# EAGLE design sonar_hotfix_3 (EAGLE 9.0.0)
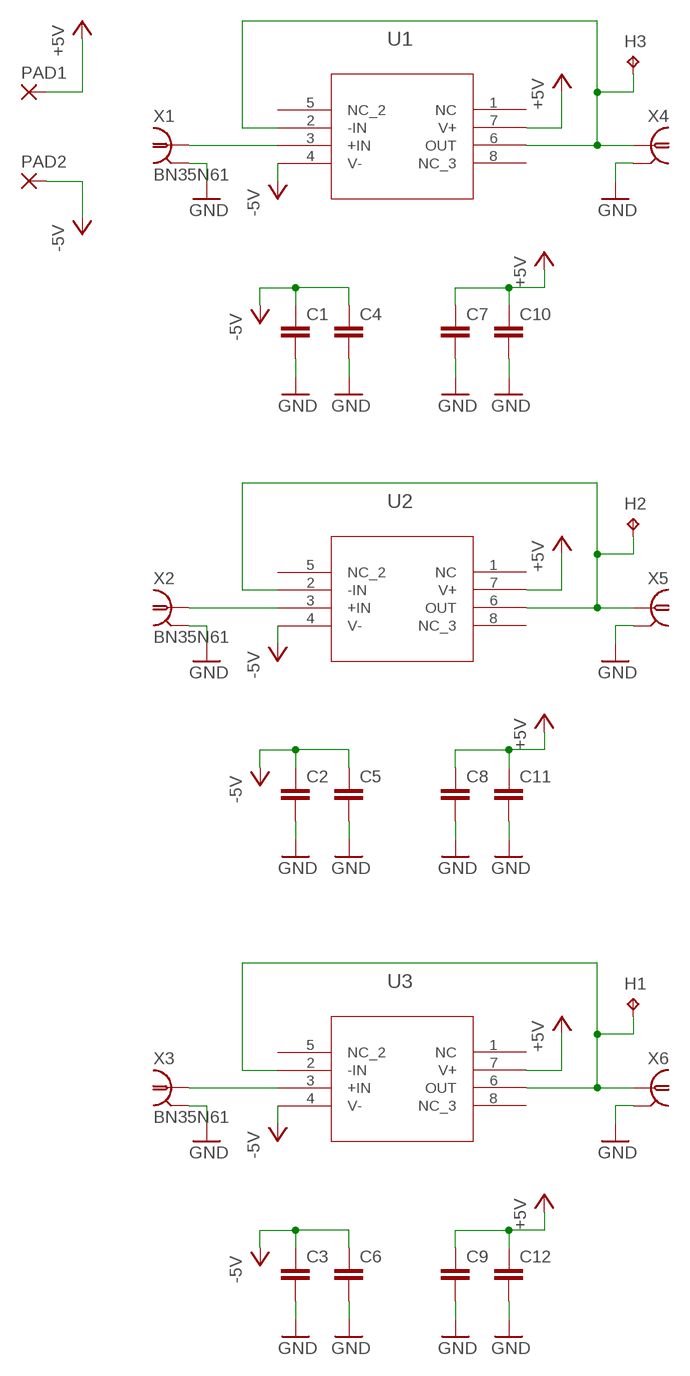
[diagram p0: schematic, sheet 1]

## Parts
C1  C-EUC0603  [C0603]
C2  C-EUC0603  [C0603]
C3  C-EUC0603  [C0603]
C4  C-EUC0603  [C0603]
C5  C-EUC0603  [C0603]
C6  C-EUC0603  [C0603]
C7  C-EUC0603  [C0603]
C8  C-EUC0603  [C0603]
C9  C-EUC0603  [C0603]
C10  C-EUC0603  [C0603]
C11  C-EUC0603  [C0603]
C12  C-EUC0603  [C0603]
H1  TPB2,54  [B2,54]
H2  TPB2,54  [B2,54]
H3  TPB2,54  [B2,54]
PAD1  WIREPADSMD5-2,5  [5-2,5]
PAD2  WIREPADSMD5-2,5  [5-2,5]
U1  LTC6240SO-8  [SO-8]
U2  LTC6240SO-8  [SO-8]
U3  LTC6240SO-8  [SO-8]
X1  BN35N61  [B35N61]
X2  BN35N61  [B35N61]
X3  BN35N61  [B35N61]
X4  BN35N61-HALF  [B35N61-HALF]
X5  BN35N61-HALF  [B35N61-HALF]
X6  BN35N61-HALF  [B35N61-HALF]

## Nets
+5V: C7.1 C8.1 C9.1 C10.1 C11.1 C12.1 PAD1.1(P) U1.7(V+) U2.7(V+) U3.7(V+)
-5V: C1.1 C2.1 C3.1 C4.1 C5.1 C6.1 PAD2.1(P) U1.4(V-) U2.4(V-) U3.4(V-)
GND: C1.2 C2.2 C3.2 C4.2 C5.2 C6.2 C7.2 C8.2 C9.2 C10.2 C11.2 C12.2 X1.2 X1.3 X1.4 X1.5 X2.2 X2.3 X2.4 X2.5 X3.2 X3.3 X3.4 X3.5 X4.2 X4.3 X5.2 X5.3 X6.2 X6.3
N$1: U1.3(+IN) X1.1
N$2: H3.TP U1.2(-IN) U1.6(OUT) X4.1
N$5: U2.3(+IN) X2.1
N$6: H2.TP U2.2(-IN) U2.6(OUT) X5.1
N$9: U3.3(+IN) X3.1
N$10: H1.TP U3.2(-IN) U3.6(OUT) X6.1
Unconnected: U1.1(NC) U1.5(NC_2) U1.8(NC_3) U2.1(NC) U2.5(NC_2) U2.8(NC_3) U3.1(NC) U3.5(NC_2) U3.8(NC_3)

## Library data of the parts
C1-C12 = rcl:C-EU: CAPACITOR, European symbol; SPICEPREFIX: C
H1-H3 = testpad:TP: Test pad
PAD1 PAD2 = wirepad:WIREPAD: Wire PAD connect wire on PCB
U1-U3 = hotfix:LTC6240
X1-X3 = ARVP:BN35N61: BNC CONNECTOR M/A COM www.macom.com distributor Farnell 149-452; OC_FARNELL: unknown; OC_NEWARK: unknown
X4-X6 = ARVP:BN35N61-HALF: BNC CONNECTOR M/A COM www.macom.com distributor Farnell 149-452

## Board
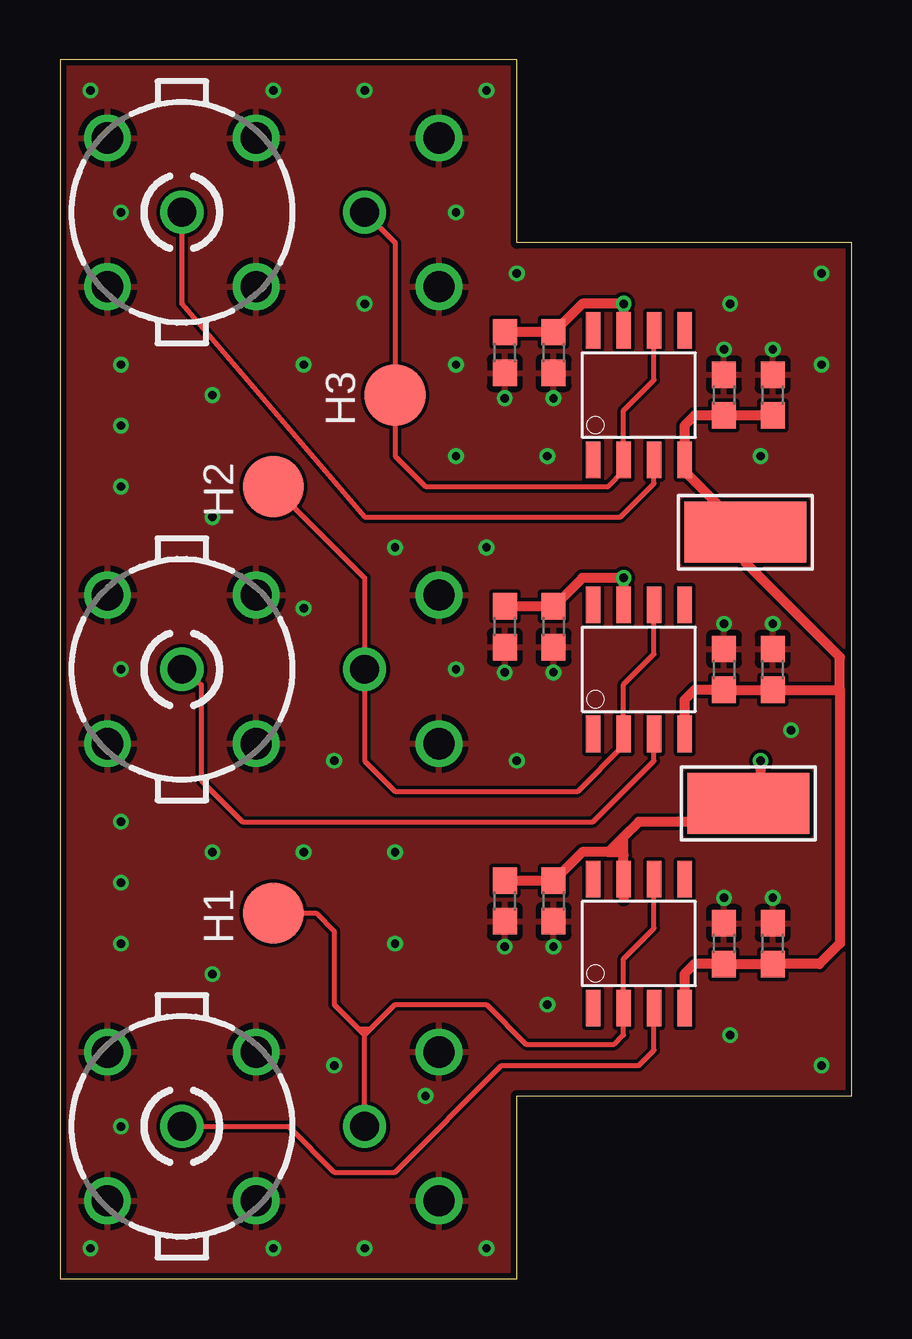
[diagram p1: board, top side]
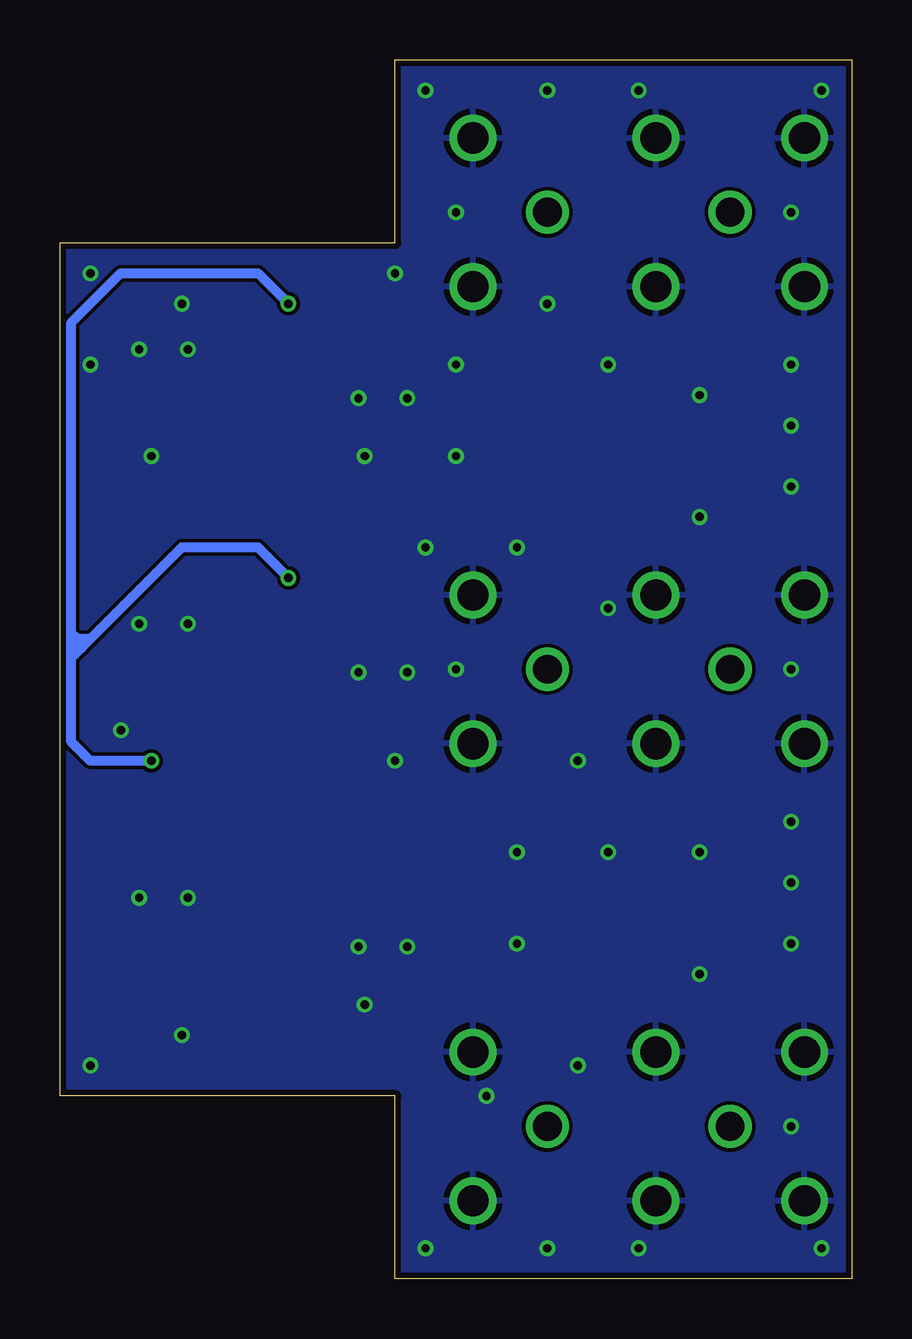
[diagram p2: board, bottom side, seen from below]

Size 33.02 x 50.8 mm. Coordinates in mm from the lower left corner, seen from the top.
Outline: 33,43.18 33.02,43.18
Outline: 33,43.18 19.05,43.18 19.05,50.8 0,50.8 0,0 19.05,0 19.05,7.62 33,7.62
Outline: 33,7.62 33,43.18
Outline: 33.02,7.62 33,7.62
Copper layers (1*16): Top 0.035mm / dielectric 1.5mm / Bottom 0.035mm
Design rules "JLCPCB2Layer": minimum track width 6mil, minimum drill 10mil, track to track 6mil, track to pad 6mil, pad to pad 6mil, via to via 6mil, smd to smd 0mil, copper to edge 10mil, drill to drill 10mil, minimum pad ring 6mil, minimum via ring 6mil, stop-mask expansion 2mil, vias tented up to drill 100mil, thermal gap 10mil

### Footprints (pad centres in the part's own frame; a part is rotated, then mirrored left to right if it is on the bottom)
C0603 = smd 1.1 x 1: 1 -0.85,0; 2 0.85,0
B2,54 = smd 2.54 x 2.54: TP 0,0
5-2,5 = smd 2.54 x 5.08: 1 0,0
SO-8 = smd 1.524 x 0.61: 1 -2.692,1.905; 2 -2.692,0.635; 3 -2.692,-0.635; 4 -2.692,-1.905; 5 2.692,-1.905; 6 2.692,-0.635; 7 2.692,0.635; 8 2.692,1.905
B35N61 = drill 1.2: 1 0,0 | drill 1.3: 2 3.099,3.099; 3 -3.099,3.099; 4 -3.099,-3.099; 5 3.099,-3.099
B35N61-HALF = drill 1.2: 1 0,0 | drill 1.3: 2 3.099,3.099; 3 -3.099,3.099

### Placement (x,y rotation side)
C1  27.69,36.83 90 top
C2  27.69,25.4 90 top
C3  27.69,13.97 90 top
C4  29.72,36.83 90 top
C5  29.72,25.4 90 top
C6  29.72,13.97 90 top
C7  18.54,38.61 270 top
C8  18.54,27.18 270 top
C9  18.54,15.75 270 top
C10  20.57,38.61 270 top
C11  20.57,27.18 270 top
C12  20.57,15.75 270 top
H1  8.89,15.24 90 top
H2  8.89,33.02 90 top
H3  13.97,36.83 90 top
PAD1  28.7,19.81 90 top
PAD2  28.58,31.11 270 top
U1  24.13,36.83 90 top
U2  24.13,25.4 90 top
U3  24.13,13.97 90 top
X1  5.08,44.45 270 top
X2  5.08,25.4 270 top
X3  5.08,6.35 270 top
X4  12.7,44.45 270 top
X5  12.7,25.4 270 top
X6  12.7,6.35 270 top

### Tracks (layer width: path | path; a pad name or v marks a point on that pad's centre or on a via)
+5V  (via drill 0.35)
  Top 0.406: 23.49,18.41 24.13,19.05 27.94,19.05 PAD1.1 29.21,20.32 v29.21,21.59 | 23.49,15.88 U3.7 23.49,17.65 | U2.7 v23.49,29.21 21.77,29.21 20.59,28.03 C11.1 C8.1 18.54,28.25 | U1.7 v23.49,40.64 21.77,40.64 20.59,39.46 C10.1 C7.1 | 23.49,17.65 23.49,18.41 | 23.49,18.41 23.11,18.03 | 23.11,18.03 22.86,17.78 | 18.54,16.82 C9.1 C12.1 20.59,16.6 21.77,17.78 22.86,17.78 | 23.37,17.78 23.11,18.03 | 22.86,17.78 23.37,17.78 | 23.37,17.78 23.49,17.65
  Bottom 0.406: v29.21,21.59 31.75,21.59 32.54,22.38 32.54,25.88 | 32.54,25.88 32.54,26.29 | 32.54,26.29 32.54,26.67 | 32.54,26.67 32.54,26.92 | 32.54,26.92 32.54,39.85 30.48,41.91 24.77,41.91 v23.49,40.64 | v23.49,29.21 24.77,30.48 27.94,30.48 31.75,26.67 | 32.13,26.29 32.54,25.88 | 32.29,26.67 32.54,26.67 | 31.75,26.67 32.13,26.29 | 32.13,26.29 32.54,26.29 | 31.75,26.67 32.29,26.67 | 32.29,26.67 32.54,26.92
-5V
  Top 0.406: C4.1 C1.1 26.45,35.98 26.03,35.56 U1.4 26.03,33.66 PAD2.1 28.58,29.84 32.51,25.91 32.51,24.55 | U3.4 26.03,12.7 26.45,13.12 C3.1 C6.1 31.66,13.12 32.51,13.97 32.51,24.55 | U2.4 26.03,24.13 26.45,24.55 C2.1 C5.1 32.51,24.55
GND  (via drill 0.35)
  other vias: 2.54,38.1 2.54,35.56 2.54,33.02 2.54,19.05 2.54,16.51 2.54,13.97 6.35,17.78 6.35,36.83 6.35,31.75 6.35,12.7 13.97,17.78 13.97,13.97 13.97,30.48 10.16,38.1 10.16,17.78 20.57,13.84 17.78,30.48 12.7,40.64 12.7,1.27 16.51,34.29 19.05,41.91 27.94,40.64 31.75,38.1 29.21,34.29 27.69,27.3 30.48,22.86 27.94,10.16 31.75,8.89 31.75,41.91 2.54,6.35 2.54,25.4 2.54,44.45 12.7,49.53 19.05,21.59 8.89,49.53 8.89,1.27 1.27,49.53 1.27,1.27 16.51,38.1 16.51,25.4 11.43,21.59 10.16,27.94 11.43,8.89 20.32,11.43 16.51,44.45 18.54,13.84 27.69,15.88 29.72,15.88 29.72,27.3 20.57,25.27 18.54,25.27 29.72,38.73 27.69,38.73 20.57,36.7 18.54,36.7 20.32,34.29 15.24,7.62 17.78,1.27 17.78,49.53
  pour Top: 0,50.8 19.05,50.8 19.05,43.18 33.02,43.18 33.02,7.62 19.05,7.62 19.05,0 0,0
  pour Bottom: 0,50.8 19.05,50.8 19.05,43.18 33.02,43.18 33.02,7.62 19.05,7.62 19.05,0 0,0
N$1
  Top 0.203: X1.1 5.08,40.64 12.7,31.75 23.37,31.75 24.77,33.15 U1.3
N$2
  Top 0.203: U1.6 24.77,37.46 23.49,36.2 U1.2 23.49,33.66 22.86,33.02 15.24,33.02 13.97,34.29 H3.TP 13.97,43.18 X4.1
N$5
  Top 0.203: X2.1 5.89,24.77 5.89,20.78 7.62,19.05 22.23,19.05 24.77,21.59 U2.3
N$6
  Top 0.203: U2.6 24.77,26.03 23.49,24.77 U2.2 23.49,22.22 21.59,20.32 13.97,20.32 12.7,21.59 X5.1 12.7,29.21 H2.TP
N$9
  Top 0.203: X3.1 9.53,6.35 11.43,4.45 13.97,4.45 18.41,8.89 24.13,8.89 24.77,9.52 U3.3
N$10
  Top 0.203: U3.6 24.77,14.6 23.49,13.33 U3.2 23.49,10.16 23.11,9.78 19.43,9.78 17.78,11.43 13.97,11.43 12.95,10.41 | X6.1 12.7,10.16 | 12.7,10.16 12.95,10.41 | 12.7,10.16 12.45,10.41 | 12.45,10.41 12.95,10.41 | H1.TP 10.67,15.24 11.43,14.48 11.43,11.43 12.45,10.41